# Altium schematic sheet UART_Driver.SchDoc: Title
size A4; Author: G.Kasprowicz; CompanyName: WUT ISE; DrawnBy: G.Kasprowicz; Organization: WUT ISE; Address1: PW ISE; Address2: Nowowiejska 15/19 00-665 Warsaw; Address3: gkasprow@gmail.com; DocumentNumber: 7; Revision: 2; SheetNumber: 7; SheetTotal: 7; ModifiedBy: -; CheckedDate: -; Title2: Title 2; DivGrp: WUT ISE; Designer: G.Kasprowicz; ModifiedDate: -; ProjectName: Sensor Box
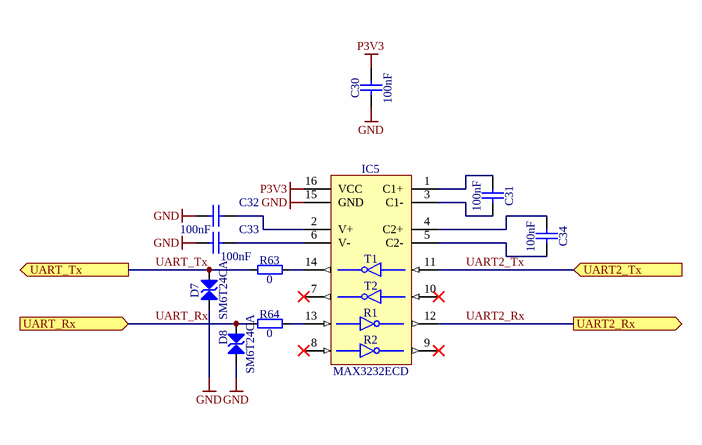
[diagram p0: UART_Driver.SchDoc]

## Parts
C30  100nF  [CAPC1608X87N]
C31  100nF  [CAPC1608X87N]
C32  100nF  [CAPC1608X87N]
C33  100nF  [CAPC1608X87N]
C34  100nF  [CAPC1608X87N]
D7  SM6T24CA  [DIOM5436X265N]
D8  SM6T24CA  [DIOM5436X265N]
IC5  MAX3232ECD  [SOIC127P600X175-16N]
R63  0  [RESC1608X55N]
R64  0  [RESC1608X55N]

## Ports
UART2_Rx (out), UART2_Tx (in), UART_Rx (in), UART_Tx (out)

## Nets
GND: C30.1 C32.2 C33.2 D7.2(A) D8.2(A) IC5.15(GND)
P3V3: C30.2 IC5.16(VCC)
UART2_Rx: IC5.12(R1OUT) ; port UART2_Rx
UART2_Tx: IC5.11(T1IN) ; port UART2_Tx
UART_Rx: D8.1(C) R64.1 ; port UART_Rx
UART_Tx: D7.1(C) R63.1 ; port UART_Tx
NetC31_1: C31.1 IC5.3(C1-)
NetC31_2: C31.2 IC5.1(C1+)
NetC32_1: C32.1 IC5.2(V+)
NetC33_1: C33.1 IC5.6(V-)
NetC34_1: C34.1 IC5.5(C2-)
NetC34_2: C34.2 IC5.4(C2+)
NetIC5_13: IC5.13(R1IN) R64.2
NetIC5_14: IC5.14(T1OUT) R63.2

Not connected (* = marked no-connect by the designer): IC5 7(T2OUT)* 8(R2IN)* 9(R2OUT)* 10(T2IN)*

## Notes on the sheet
- Project/Equipment
- Document
- Designer
- Drawn by
- Check.by
- F.Świtakowski
- 01.20201
- PW ISE
- Contact
- File
- Last Mod.
- Print Date
- Sheet
- Size
- A4
- of
- 1
- Rev
- Copyright WUT ISE 2021.
  This documentation describes Open Hardware and is licensed under the CERN OHL v.1.2. You may redistribute and modify this documentation under the terms of the CERN OHL v.1.2. (http://ohwr.org/CERNOHL). This documentation is distributed WITHOUT ANY EXPRESS OR IMPLIED WARRANTY, INCLUDING OF MERCHANTABILITY, SATISFACTORY QUALITY AND FITNESS FOR A PARTICULAR PURPOSE. Please see the CERN OHL v.1.2 for applicable conditions.
- Nowowiejska 15/19 00-665 Warsaw
- (in symbol MAX3232ECD) T1; T2; R1; R2

## Library data of the parts
C30-C34 = CC0603_100NF_50V_10%_X7R: Non-polarised capacitor; Part Description: SMD Multilayer Chip Ceramic Capacitor; Manufacturer: GENERIC; Manufacturer1 Part Number: 223858615649; Voltage: 50V; TC: X7R; Tolerance: ±10%; Part Number: CC0603_100NF_50V_10%_X7R; Component Kind: Standard; Component Type: Standard; Pin Count: 2; Value: 100nF; Status: Preferred; Manufacturer Part Number: CC0603_100NF_50V_10%_X7R; Case: 0603; Mounted: Yes; Socket: No; SMD: Yes; Sense: No; Manufacturer1 Example: PHYCOMP; Manufacturer1 ComponentHeight: 0.87mm; HelpURL: \\cern.ch\dfs\Applications\Altium\Datasheets\CC0603_X7R_PHYCOMP.pdf; Author: CERN DEM JLC; CreateDate: 03.12.2007; LatestRevisionDate: 03.12.2007
D7 D8 = SM6T24CA: Transient Voltage Suppressor Diode (Bi-Directional); Part Description: Bi-Directional Transient Voltage Suppressor Diode; Manufacturer: ST MICROELECTRONICS; Voltage: 24V; Power: 600W; PressFit: No; Bonding: No; Part Number: SM6T24CA; Component Kind: Standard; Component Type: Standard; Device: SM6T24CA; PackageDescription: DO-214-AA/SMB Molded Diode, Body 5.4x3.6mm, IPC Medium Density; Manufacturer Part Number: SM6T24CA; Pin Count: 2; Case: DO-214AA; Mounted: Yes; Socket: No; SMD: Yes; Sense: No; ComponentHeight: 2.65mm; HelpURL: \\cern.ch\dfs\Applications\Altium\Datasheets\SM6T24CA.pdf; Author: CERN DEM JMW; CreateDate: 12.05.2015; LatestRevisionDate: 12.05.2015
IC5 = MAX3232ECD: 3-V To 5.5-V Multichannel RS-232 Line Driver/Receiver With ±15kV IEC ESD Protection; Part Description: 3V To 5.5V Multichannel RS-232 Line Driver/Receiver With ±15kV IEC ESD Protection; Manufacturer: TEXAS INSTRUMENTS; PressFit: No; Bonding: No; Part Number: MAX3232ECD; Component Kind: Standard; Component Type: Standard; Device: MAX3232ECD; PackageDescription: SOIC 16, Pitch 1.27mm - Body 4x10mm, IPC Medium Density; Manufacturer Part Number: MAX3232ECD; Pin Count: 16; Case: SOIC16; Mounted: Yes; Socket: No; SMD: Yes; Sense: No; ComponentHeight: 1.75mm; Author: CERN DEM JLC; HelpURL: \\cern.ch\dfs\Applications\Altium\Datasheets\MAX3232ECD.pdf; CreateDate: 15.07.2010; LatestRevisionDate: 10.01.2012
R63 R64 = R0603_0R_JUMPER: Resistor; Part Description: 1A (0.05R Max DC Resistance) Zero Ohm Jumper; Manufacturer: GENERIC; Manufacturer1 Part Number: NRC06Z0; PressFit: No; Part Number: R0603_0R_JUMPER; Component Kind: Standard; Component Type: Standard; Pin Count: 2; Value: 0; Status: Preferred; Manufacturer Part Number: R0603_0R_JUMPER; Case: 0603; Mounted: Yes; Sense: No; Socket: No; SMD: Yes; Manufacturer1 Example: NIC COMPONENT; Manufacturer1 ComponentHeight: 0.55mm; HelpURL: \\cern.ch\dfs\Applications\Altium\Datasheets\R0603_NIC_NRC.pdf; Author: CERN DEM JLC; CreateDate: 03.12.2007; LatestRevisionDate: 13.03.2008